# Altium schematic sheet micromouse_v1.SchDoc
size A2; SheetNumber: 1; SheetTotal: 1
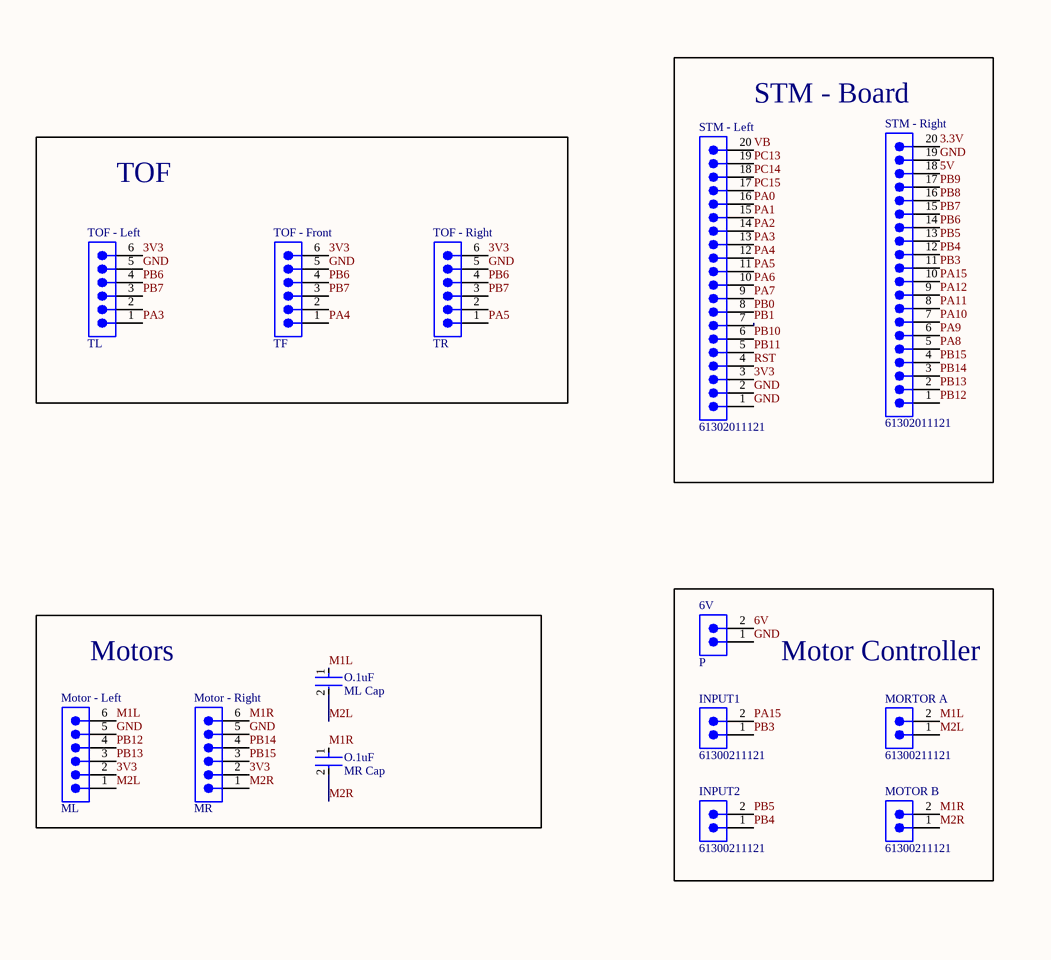
[diagram p0: micromouse_v1.SchDoc, left]
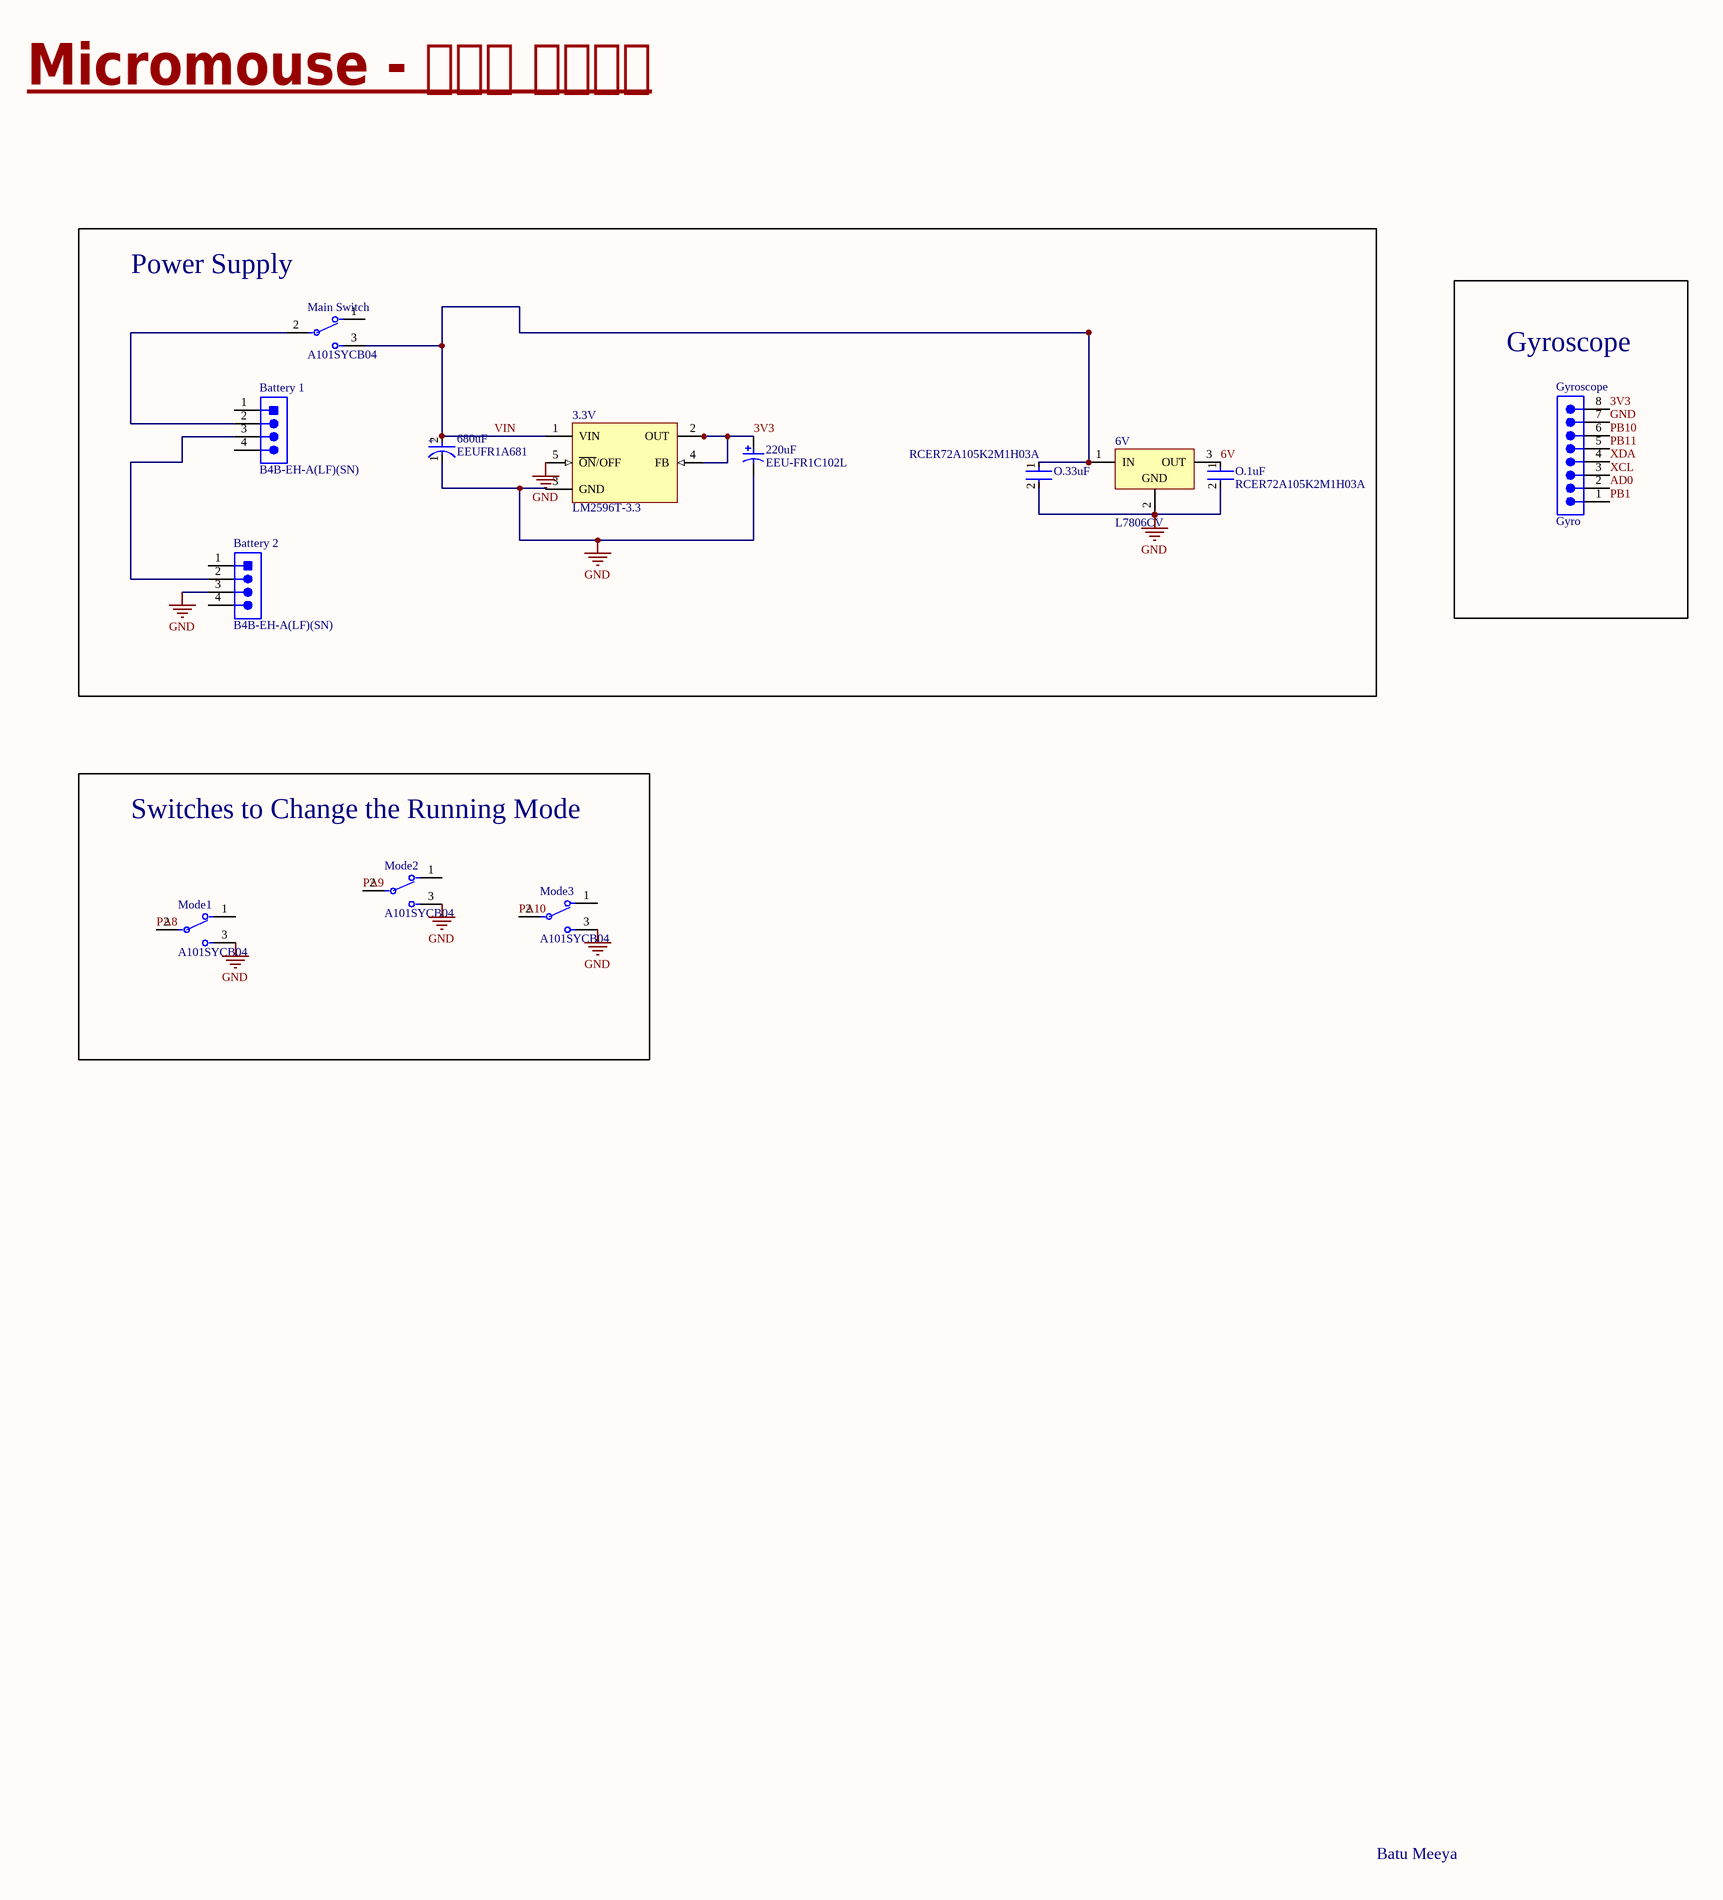
[diagram p1: micromouse_v1.SchDoc, right]

## Parts
(Parts that share a designator on the sheet are numbered #1, #2 ... from top to bottom, then left to right.)
3.3V  LM2596T-3.3  [T05D]
6V#1  L7806CV  [TO220]
6V#2  P  [61300211121]
220uF  EEU-FR1C102L  [PNSC-FR-A-8X20-2_V]
680uF  EEUFR1A681  [FP-RAD-TH-D_8_0_5-L_11_5-MFG]
Battery_1  B4B-EH-A(LF)(SN)  [JST-B4B-EH-A_V]
Battery_2  B4B-EH-A(LF)(SN)  [JST-B4B-EH-A_V]
Gyroscope  Gyro  [61300811121]
INPUT1  61300211121  [61300211121]
INPUT2  61300211121  [61300211121]
Main_Switch  A101SYCB04  [FP-A101SYCB04-MFG]
Mode1  A101SYCB04  [FP-A101SYCB04-MFG]
Mode2  A101SYCB04  [FP-A101SYCB04-MFG]
Mode3  A101SYCB04  [FP-A101SYCB04-MFG]
MORTOR_A  61300211121  [61300211121]
Motor_-_Left  ML  [61300611121]
Motor_-_Right  MR  [61300611121]
MOTOR_B  61300211121  [61300211121]
O.1uF#1  RCER72A105K2M1H03A  [FP-RCE2K1-MFG]
O.1uF#2  ML Cap  [FP-RCE2K1-MFG]
O.1uF#3  MR Cap  [FP-RCE2K1-MFG]
O.33uF  RCER72A105K2M1H03A  [FP-RCE2K1-MFG]
STM_-_Left  61302011121  [61302011121]
STM_-_Right  61302011121  [61302011121]
TOF_-_Front  TF  [61300611121]
TOF_-_Left  TL  [61300611121]
TOF_-_Right  TR  [61300611121]

## Blocks framed on the sheet
Power Supply: 3.3V 6V#1 220uF 680uF Battery_1 Battery_2 Main_Switch O.1uF#1 O.33uF
STM - Board: STM_-_Left STM_-_Right
Gyroscope: Gyroscope
TOF: TOF_-_Front TOF_-_Left TOF_-_Right
Motor Controller: 6V#2 INPUT1 INPUT2 MORTOR_A MOTOR_B
Switches to Change the Running Mode: Mode1-Mode3

## Nets
GND: 3.3V.5(~{ON}/OFF) 6V#1.2(GND) 6V#2.1 220uF.2 680uF.1(C) Battery_2.3 Gyroscope.7 Mode1.3 Mode2.3 Mode3.3 Motor_-_Left.5 Motor_-_Right.5 O.1uF#1.2 O.33uF.2 STM_-_Left.1 STM_-_Left.2 STM_-_Right.19 TOF_-_Front.5 TOF_-_Left.5 TOF_-_Right.5
3.3V: STM_-_Right.20
3V3: 3.3V.2(OUT) 3.3V.4(FB) 220uF.1 Gyroscope.8 Motor_-_Left.2 Motor_-_Right.2 STM_-_Left.3 TOF_-_Front.6 TOF_-_Left.6 TOF_-_Right.6
5V: STM_-_Right.18
6V: 6V#1.3(OUT) 6V#2.2 O.1uF#1.1
AD0: Gyroscope.2
M1L: MORTOR_A.2 Motor_-_Left.6 O.1uF#2.1
M1R: Motor_-_Right.6 MOTOR_B.2 O.1uF#3.1
M2L: MORTOR_A.1 Motor_-_Left.1 O.1uF#2.2
M2R: Motor_-_Right.1 MOTOR_B.1 O.1uF#3.2
PA0: STM_-_Left.16
PA1: STM_-_Left.15
PA2: STM_-_Left.14
PA3: STM_-_Left.13 TOF_-_Left.1
PA4: STM_-_Left.12 TOF_-_Front.1
PA5: STM_-_Left.11 TOF_-_Right.1
PA6: STM_-_Left.10
PA7: STM_-_Left.9
PA8: Mode1.2 STM_-_Right.5
PA9: Mode2.2 STM_-_Right.6
PA10: Mode3.2 STM_-_Right.7
PA11: STM_-_Right.8
PA12: STM_-_Right.9
PA15: INPUT1.2 STM_-_Right.10
PB0: STM_-_Left.8
PB1: Gyroscope.1 STM_-_Left.7
PB3: INPUT1.1 STM_-_Right.11
PB4: INPUT2.1 STM_-_Right.12
PB5: INPUT2.2 STM_-_Right.13
PB6: STM_-_Right.14 TOF_-_Front.4 TOF_-_Left.4 TOF_-_Right.4
PB7: STM_-_Right.15 TOF_-_Front.3 TOF_-_Left.3 TOF_-_Right.3
PB8: STM_-_Right.16
PB9: STM_-_Right.17
PB10: Gyroscope.6 STM_-_Left.6
PB11: Gyroscope.5 STM_-_Left.5
PB12: Motor_-_Left.4 STM_-_Right.1
PB13: Motor_-_Left.3 STM_-_Right.2
PB14: Motor_-_Right.4 STM_-_Right.3
PB15: Motor_-_Right.3 STM_-_Right.4
PC13: STM_-_Left.19
PC14: STM_-_Left.18
PC15: STM_-_Left.17
RST: STM_-_Left.4
VB: STM_-_Left.20
VIN: 3.3V.1(VIN) 6V#1.1(IN) 680uF.2(A) Main_Switch.3 O.33uF.1
XCL: Gyroscope.3
XDA: Gyroscope.4
NetBattery_1_2: Battery_1.2 Main_Switch.2
NetBattery_1_3: Battery_1.3 Battery_2.2

Not connected (* = marked no-connect by the designer): 3.3V 3(GND); Battery_1 1 4; Battery_2 1 4; Main_Switch 1; Mode1 1; Mode2 1; Mode3 1; TOF_-_Front 2; TOF_-_Left 2; TOF_-_Right 2

## Notes on the sheet
- Micromouse - බටු මීයා
- Motors
- Batu Meeya
- (in symbol CMP-05427-000255-1) +

## Library data of the parts
3.3V = CMP-0069-01929-2: SIMPLE SWITCHER® Power Converter 150 KHz 3A Step-Down Voltage Regulator, 5-pin TO-220; Manufacturer: National Semiconductor; PackageTopMarking: NSUZXYTTE#*LM2596T*-3.3 P+; PowerWise: N; CompType: Switcher; ComponentLink1URL: http://www.national.com/ds/LM/LM2596.pdf; ComponentLink2URL: http://www.national.com/pf/LM/LM2596.html; RoHS: N; RevisionNote: Component URLs added; PackageVersion: revA, Oct-1989; ComponentLink1Description: LM2596 Datasheet; DatasheetVersion: May-2002; ComponentLink3URL: http://www.national.com/packaging/folders/t05d.html; PackageDescription: TO-220, Molded, Stagger Bend, 5 Lead; ComponentLink3Description: T05D Package Page; PackageReference: T05D; PinCount: 5; ComponentLink2Description: LM2596 Web Page
6V#1 = CMP-0244-00495-1: Positive Voltage Regulator, 6V, 3-Pin TO-220; PackageDescription: TO, Thru-Hole, Vertical, Heatsink Mounted; 3 In-Line Leads; Pitch 2.54 mm; ComponentLink3Description: Package Specification; PackageReference: TO220; PackageVersion: ver3.0; DatasheetVersion: 16/11/2011; ComponentLink3URL: http://www.st.com/internet/com/TECHNICAL_RESOURCES/TECHNICAL_LITERATURE/PACKAGE_INFORMATION/CD00004649.pdf; ComponentLink2Description: Datasheet; ComponentLink2URL: http://www.st.com/internet/com/TECHNICAL_RESOURCES/TECHNICAL_LITERATURE/DATASHEET/CD00000444.pdf; ComponentLink1Description: Manufacturer URL; ComponentLink1URL: http://www.st.com
6V#2 INPUT1 INPUT2 MORTOR_A MOTOR_B = CMP-1712-00002-6: NexarPartId: 20081794; Number of Contacts: 2; Pitch: 2.54mm; Connector Type: Male Pin; Voltage Rating: 250V; Current Rating: 3A; Gender: Male; Contact Resistance: 20mΩ; Height: 8.94mm; Lead Free: Lead Free; Number of Pins: 2; Termination: Through Hole; RoHS: Compliant; Lead Pitch: 2.54mm; REACH SVHC: No SVHC; Housing Material: PBT; Contact Mating Length: 5.9944mm; Min Operating Temperature: -40°C; Orientation: Vertical; Contact Material: Copper; Contact Gender: Male; Max Operating Temperature: 125°C; Number of Rows: 1; Number of Positions: 2; Packaging: Bulk; Contact Plating: Gold; Mount: Through Hole; Color: Black; Operating Supply Voltage: 250V
220uF = CMP-0744-00002-1: Aluminum Electrolytic Capacitor, 1000 uF +/- 20%, 16 V, -40 to 105 degC, 2-Pin THD, Dia 8 mm, Body Length 22 mm, RoHS; Manufacturer: Panasonic; Rated Voltage: 16 V; Resistance: 0.03 Ohm; Tolerance: +/- 20%; Rated Ripple Current: 1560 mA; Capacitance: 1000 uF; ComponentLink2URL: http://www.panasonic.com/industrial/includes/pdf/EEU-FR_DataSheet.pdf; DatasheetVersion: Apr-10; Temperature Range: -40 to 105 degC; ComponentLink1Description: Manufacturer URL; ComponentLink1URL: http://www.panasonic.com/industrial/electronic-components/; PartNumber: EEU-FR1C102L; PackageDescription: 2-Pin Radial Lead, Dia 8 mm, Body Length 22 mm, Pin Spacing 3.5 mm; PackageReference: FR-A-8X20-2; Mounting Technology: Through Hole; RoHS: TRUE; ComponentLink2Description: Datasheet
680uF = CMP-05427-000255-1: Aluminum Electrolytic Capacitors (Radial Lead Type) 680uF ±20% 10V; Ripple Current (AC): 950mA; Lead/Base Style: Straight; Lead Diameter: 0.6mm; Impedance: 56mR; Life (Hours): 6000Hour; Radiation Hardening: No; Height - Seated (Max): 0.512inch; Voltage Rating (DC): 10V; REACH SVHC: No SVHC; Termination: Radial; Length: 11.5mm; Series: FR; Packaging: Bulk; Lead Pitch: 3.5mm; Construction: RADIAL; Min Operating Temperature: -40°C; Height: 11.5mm; Contact Plating: Tin; Diameter: 8mm; Capacitance: 680uF; Max Operating Temperature: 105°C; Tolerance: 20%; Voltage: 10V; Package Quantity: 200; Case/Package: Radial; Voltage Rating: 10V; RoHS Compliant: Yes; Mount: Through Hole; ESR (Equivalent Series Resistance): 56mR; Ripple Current: 950mA; Lead Free: Lead Free; Number of Pins: 2
Battery_1 Battery_2 = CMP-2000-05904-1: Male Header, Pitch 2.5 mm, 1 x 4 Position, Height 6 mm, Tail Length 3.2 mm, -25 to 85 degC, RoHS, Bulk; Manufacturer: JST; Style/Orientation: StraightHeader/Plug; Pitch: 2.5mm; No of Positions: 4; Mounting Technology: SurfaceMount; Package Description: Male Header, Pitch 2.5 mm, 1 x 4 Position, Height 6 mm, Tail Length 3.2 mm; Datasheet Version: 12/2012; Type: ShroudedHeader; Package Reference: B4B-EH-A; Manufacturer URL: http://www.jst.com/home2.html; Termination: Crimp; Datasheet URL: http://www.jst-mfg.com/product/pdf/eng/eEH.pdf
Gyroscope = CMP-1502-01076-3: NexarPartId: 32855533; Connector Type: Male Pin; Number of Contacts: 8; Voltage Rating: 250V; Current Rating: 3A; Contact Resistance: 20mΩ; Pitch: 2.54mm; Gender: Male; Termination: Solder; Contact Material: Copper; Mount: Through Hole; Lead Pitch: 2.54mm; Number of Positions: 8; Operating Supply Voltage: 250V; Number of Pins: 8; Max Operating Temperature: 105°C; Height: 8.54mm; REACH SVHC: Unknown; Number of Rows: 1; Packaging: Bulk; Contact Plating: Gold; Contact Mating Length: 5.9944mm; Orientation: Vertical; RoHS: Compliant; Color: Black; Min Operating Temperature: -40°C
Main_Switch Mode1-Mode3 = CMP-03408-000017-1: SWITCH TOGGLE SPDT 0.4VA 20V; Electrical Life: 6000Cycles; Number of Poles: 1; Power Rating: 400mW; Switch Function: On-On; Contact Resistance: 10mR; Contact Current Rating: 400mA; Actuator Material: Phenolic; Insulation Resistance: 30MR; Actuator Color: Chrome; Number of Positions: 2; Actuator Type: Standard Round; Actuator Length: 10.41mm; Illumination Type: Non-Illuminated; Flammability Rating: UL94 V-1; Contact Material: Copper; Depth: 6.86mm; Contact Plating: Gold; Voltage Rating (AC): 20V; Max Voltage Rating (DC): 20V; Min Operating Temperature: -30°C; Max Operating Temperature: 85°C; Throw Configuration: SPDT; Packaging: Bulk; Termination: PC Pins; Series: Gemini A; ELV: Compliant; Lead Free: Lead Free; RoHS Compliant: Yes; REACH SVHC: No SVHC; Mount: Panel; Orientation: Straight; Package Quantity: 100; Max Voltage Rating (AC): 20V; Radiation Hardening: No; Voltage Rating (DC): 20V
Motor_-_Left Motor_-_Right TOF_-_Front TOF_-_Left TOF_-_Right = CMP-1502-01070-3: NexarPartId: 20084590; Current Rating: 3A; Pitch: 2.54mm; Gender: Male; Operating Supply Voltage: 250V; Connector Type: Male Pin; Number of Positions: 6; Contact Resistance: 20mΩ; Packaging: Bulk; Number of Pins: 6; Number of Rows: 1; Contact Plating: Gold; Lead Free: Lead Free; RoHS: Compliant; Contact Mating Length: 5.9944mm; Voltage Rating: 250V; REACH SVHC: Unknown; Contact Gender: Male; Housing Material: PBT; Min Operating Temperature: -40°C; Lead Pitch: 2.54mm; Mount: Through Hole; Number of Contacts: 6; Max Operating Temperature: 105°C; Contact Material: Copper; Orientation: Vertical; Termination: Through Hole; Color: Black; Height: 8.89mm
O.1uF#1-O.1uF#3 O.33uF = CMP-06035-007361-1: Cap Ceramic Monolithic 1uF 100V 10% Thru-Hole Bulk; Lead Diameter: 0.5mm; Lead/Base Style: Formed Leads; Dielectric: X7R; Voltage Rating (DC): 100V; Tolerance: 10%; Width: 0.124inch; Termination: Radial; Length: 0.217inch; Height: 4mm; Ratings: AEC-Q200; Package Quantity: 2000; Mount: Through Hole; Height - Seated (Max): 0.157inch; Case/Package: Radial; Resistor Type: Ceramic; Lead Pitch: 0.197inch; Lead Free: Lead Free; Packaging: Tape and Reel; Voltage Rating: 100V; Min Operating Temperature: -55°C; Max Operating Temperature: 125°C; Capacitance: 1uF
STM_-_Left STM_-_Right = CMP-1502-01102-3: NexarPartId: 32855554; Operating Supply Voltage: 250V; Gender: Male; Current Rating: 3A; Contact Resistance: 20mΩ; Number of Contacts: 20; Pitch: 2.54mm; Connector Type: Male Pin; RoHS: Compliant; Contact Plating: Gold; REACH SVHC: Unknown; Packaging: Bulk; Lead Pitch: 2.54mm; Mount: Through Hole; Termination: Solder; Number of Pins: 20; Contact Mating Length: 5.9944mm; Number of Rows: 1; Color: Black; Contact Material: Copper; Orientation: Vertical; Number of Positions: 20